# Altium schematic sheet SENSOR.SchDoc
size A4
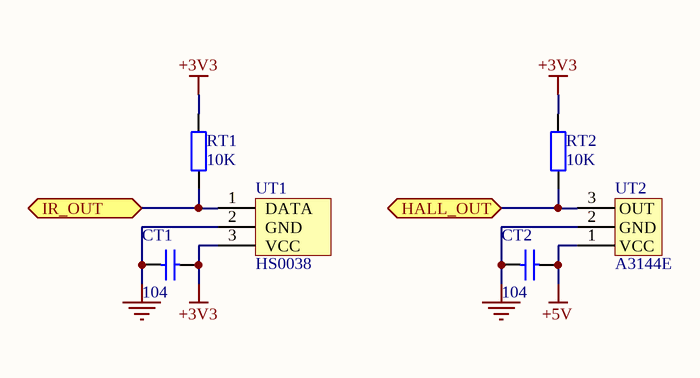
[diagram p0: SENSOR.SchDoc]

## Parts
CT1  value 104  [CAPC1608N]  (hidden comment: Cap1)
CT2  value 104  [CAPC1608N]  (hidden comment: Cap1)
RT1  value 10K  [RESC1608N]  (hidden comment: Res1)
RT2  value 10K  [RESC1608N]  (hidden comment: Res1)
UT1  HS0038  [HS0038]
UT2  A3144E  [A3144E]

## Ports
HALL_OUT, IR_OUT

## Nets
+3V3: CT1.1 RT1.1 RT2.1 UT1.3(VCC)
+5V: CT2.1 UT2.1(VCC)
GND: CT1.2 CT2.2 UT1.2(GND) UT2.2(GND)
HALL_OUT: RT2.2 UT2.3(OUT) ; port HALL_OUT
IR_OUT: RT1.2 UT1.1(DATA) ; port IR_OUT

## Library data of the parts
CT1 CT2 = Cap1: Capacitor; Published: 8-Jun-2000; LatestRevisionDate: 17-Jul-2002; LatestRevisionNote: Re-released for DXP Platform.; PackageReference: RAD-0.3; Publisher: Altium Limited
RT1 RT2 = Res1: Resistor; Published: 8-Jun-2000; LatestRevisionDate: 17-Jul-2002; LatestRevisionNote: Re-released for DXP Platform.; PackageReference: AXIAL-0.4; Publisher: Altium Limited